# EAGLE design robo1 (EAGLE 8.0.1)
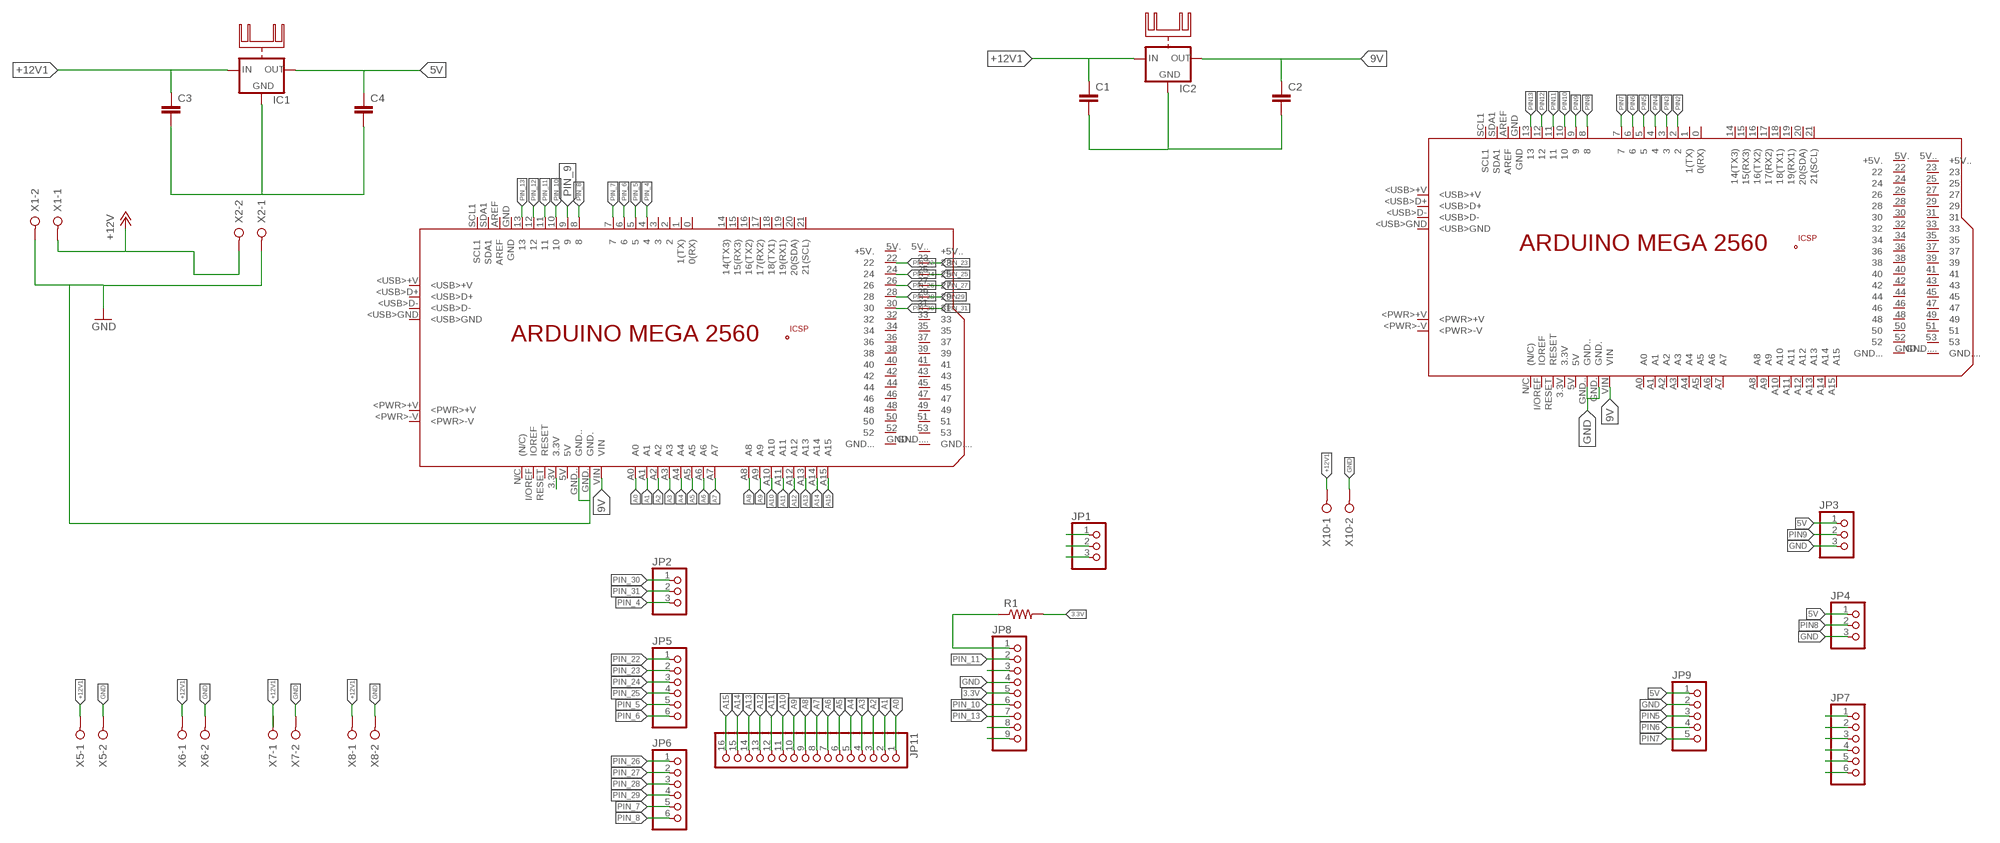
[diagram p0: schematic, sheet 1]

## Parts
C1  C5/2.5  [C5B2.5]
C2  C5/2.5  [C5B2.5]
C3  C5/2.5  [C5B2.5]
C4  C5/2.5  [C5B2.5]
IC1  78XXH  [78XXH]
IC2  78XXH  [78XXH]
JP1  PINHD-1X3  [1X03]
JP2  PINHD-1X3  [1X03]
JP3  PINHD-1X3  [1X03]
JP4  PINHD-1X3  [1X03]
JP5  PINHD-1X6  [1X06]
JP6  PINHD-1X6  [1X06]
JP7  PINHD-1X6  [1X06]
JP8  PINHD-1X9  [1X09]
JP9  PINHD-1X5  [1X05]
JP11  PINHD-1X16  [1X16]
MEGA1  ARDUINO_MEGA2560  [ARDUINO_MEGA2560]
MEGA2  ARDUINO_MEGA2560  [ARDUINO_MEGA2560]
R1  R-US_0207/10  [0207/10]
X1  W237-02P  [W237-132]
X2  W237-02P  [W237-132]
X5  W237-02P  [W237-132]
X6  W237-02P  [W237-132]
X7  W237-02P  [W237-132]
X8  W237-02P  [W237-132]
X10  W237-02P  [W237-132]

## Nets
3.3V: JP8.5 MEGA1.3.3V R1.2
5V: C4.1 IC1.OUT JP3.1 JP4.1 JP9.1
9V: C2.1 IC2.OUT MEGA1.VIN MEGA2.VIN
+12V: X1.1 X2.2
+12V1: C1.1 C3.1 IC1.IN IC2.IN X5.1 X6.1 X8.1 X10.1
A0: JP11.1 MEGA1.A0
A1: JP11.2 MEGA1.A1
A2: JP11.3 MEGA1.A2
A3: JP11.4 MEGA1.A3
A4: JP11.5 MEGA1.A4
A5: JP11.6 MEGA1.A5
A6: JP11.7 MEGA1.A6
A7: JP11.8 MEGA1.A7
A8: JP11.9 MEGA1.A8
A9: JP11.10 MEGA1.A9
A10: JP11.11 MEGA1.A10
A11: JP11.12 MEGA1.A11
A12: JP11.13 MEGA1.A12
A13: JP11.14 MEGA1.A13
A14: JP11.15 MEGA1.A14
A15: JP11.16 MEGA1.A15
GND: C1.2 C2.2 C3.2 C4.2 IC1.GND IC2.GND JP1.1 JP3.3 JP4.3 JP8.4 JP9.2 MEGA1.GND. MEGA1.GND.. MEGA2.GND. MEGA2.GND.. X1.2 X2.1 X5.2 X6.2 X7.2 X8.2 X10.2
N$26: JP1.2
N$34: JP8.3
N$39: JP8.8
N$40: JP8.9
PIN2: JP7.1 MEGA2.2
PIN3: JP7.2 MEGA2.3
PIN4: MEGA2.4
PIN5: JP9.3 MEGA2.5
PIN6: JP9.4 MEGA2.6
PIN7: JP9.5 MEGA2.7
PIN8: JP4.2 MEGA2.8
PIN9: JP3.2 MEGA2.9
PIN10: JP7.3 MEGA2.10
PIN11: JP7.4 MEGA2.11
PIN12: JP7.5 MEGA2.12
PIN13: JP7.6 MEGA2.13
PIN_4: JP2.3 MEGA1.4
PIN_5: JP5.5 MEGA1.5
PIN_6: JP5.6 MEGA1.6
PIN_7: JP6.5 MEGA1.7
PIN_8: JP6.6 MEGA1.8
PIN_9: JP1.3 MEGA1.9
PIN_10: JP8.6 MEGA1.10
PIN_11: JP8.2 MEGA1.11
PIN_12: JP8.1 MEGA1.12 R1.1
PIN_13: JP8.7 MEGA1.13
PIN_22: JP5.1 MEGA1.22
PIN_23: JP5.2
PIN_24: JP5.3 MEGA1.24
PIN_25: JP5.4
PIN_26: JP6.1 MEGA1.26
PIN_27: JP6.2
PIN_28: JP6.3 MEGA1.28
PIN_29: JP6.4
PIN_30: JP2.1 MEGA1.30
PIN_31: JP2.2
Unconnected: MEGA1.0(0(RX)) MEGA1.1(1(TX)) MEGA1.2 MEGA1.3 MEGA1.5V MEGA1.5V.(+5V.) MEGA1.5V..(+5V..) MEGA1.14(14(TX3)) MEGA1.15(15(RX3)) MEGA1.16(16(TX2)) MEGA1.17(17(RX2)) MEGA1.18(18(TX1)) MEGA1.19(19(RX1)) MEGA1.20(20(SDA)) MEGA1.21(21(SCL)) MEGA1.23 MEGA1.25 MEGA1.27 MEGA1.29 MEGA1.31 MEGA1.32 MEGA1.33 MEGA1.34 MEGA1.35 MEGA1.36 MEGA1.37 MEGA1.38 MEGA1.39 MEGA1.40 MEGA1.41 MEGA1.42 MEGA1.43 MEGA1.44 MEGA1.45 MEGA1.46 MEGA1.47 MEGA1.48 MEGA1.49 MEGA1.50 MEGA1.51 MEGA1.52 MEGA1.53 MEGA1.+5V_ MEGA1.<PWR>+V MEGA1.<PWR>-V MEGA1.<USB>+V MEGA1.<USB>D+ MEGA1.<USB>D- MEGA1.<USB>GND MEGA1.AREF MEGA1.GND MEGA1.GND... MEGA1.GND.... MEGA1.GND__ MEGA1.I/OREF(IOREF) MEGA1.MISO MEGA1.MOSI MEGA1.N/C((N/C)) MEGA1.RESET MEGA1.RESET. MEGA1.SCK MEGA1.SCL1 MEGA1.SDA1 MEGA2.0(0(RX)) MEGA2.1(1(TX)) MEGA2.3.3V MEGA2.5V MEGA2.5V.(+5V.) MEGA2.5V..(+5V..) MEGA2.14(14(TX3)) MEGA2.15(15(RX3)) MEGA2.16(16(TX2)) MEGA2.17(17(RX2)) MEGA2.18(18(TX1)) MEGA2.19(19(RX1)) MEGA2.20(20(SDA)) MEGA2.21(21(SCL)) MEGA2.22 MEGA2.23 MEGA2.24 MEGA2.25 MEGA2.26 MEGA2.27 MEGA2.28 MEGA2.29 MEGA2.30 MEGA2.31 MEGA2.32 MEGA2.33 MEGA2.34 MEGA2.35 MEGA2.36 MEGA2.37 MEGA2.38 MEGA2.39 MEGA2.40 MEGA2.41 MEGA2.42 MEGA2.43 MEGA2.44 MEGA2.45 MEGA2.46 MEGA2.47 MEGA2.48 MEGA2.49 MEGA2.50 MEGA2.51 MEGA2.52 MEGA2.53 MEGA2.+5V_ MEGA2.<PWR>+V MEGA2.<PWR>-V MEGA2.<USB>+V MEGA2.<USB>D+ MEGA2.<USB>D- MEGA2.<USB>GND MEGA2.A0 MEGA2.A1 MEGA2.A2 MEGA2.A3 MEGA2.A4 MEGA2.A5 MEGA2.A6 MEGA2.A7 MEGA2.A8 MEGA2.A9 MEGA2.A10 MEGA2.A11 MEGA2.A12 MEGA2.A13 MEGA2.A14 MEGA2.A15 MEGA2.AREF MEGA2.GND MEGA2.GND... MEGA2.GND.... MEGA2.GND__ MEGA2.I/OREF(IOREF) MEGA2.MISO MEGA2.MOSI MEGA2.N/C((N/C)) MEGA2.RESET MEGA2.RESET. MEGA2.SCK MEGA2.SCL1 MEGA2.SDA1 X7.1

## Library data of the parts
C1-C4 = capacitor-wima:C: CAPACITOR naming: grid - package width; OC_FARNELL: unknown
IC1 IC2 = 78xx_with_heatsink:78XXH: VOLTAGE REGULATOR; OC_FARNELL: unknown
JP1-JP4 = pinhead:PINHD-1X3: PIN HEADER
JP5-JP7 = pinhead:PINHD-1X6: PIN HEADER
JP8 = pinhead:PINHD-1X9: PIN HEADER
JP9 = pinhead:PINHD-1X5: PIN HEADER
JP11 = pinhead:PINHD-1X16: PIN HEADER
MEGA1 MEGA2 = E14_Arduino_revC:ARDUINO_MEGA2560: Device for representing an Arduino Mega 2560 board with a footprint in an EAGLE design. Created by Dave Young for Element14. More EAGLE documentation at: http://www.element14.com/community/community/knode/cadsoft_eagle; OC_FARNELL: unknown
R1 = resistor:R-US_: RESISTOR, American symbol; OC_FARNELL: unknown
X1 X2 X5-X8 X10 = con-wago-508:W237-02P: WAGO SREW CLAMP; OC_FARNELL: unknown; OC_NEWARK: unknown

## Board
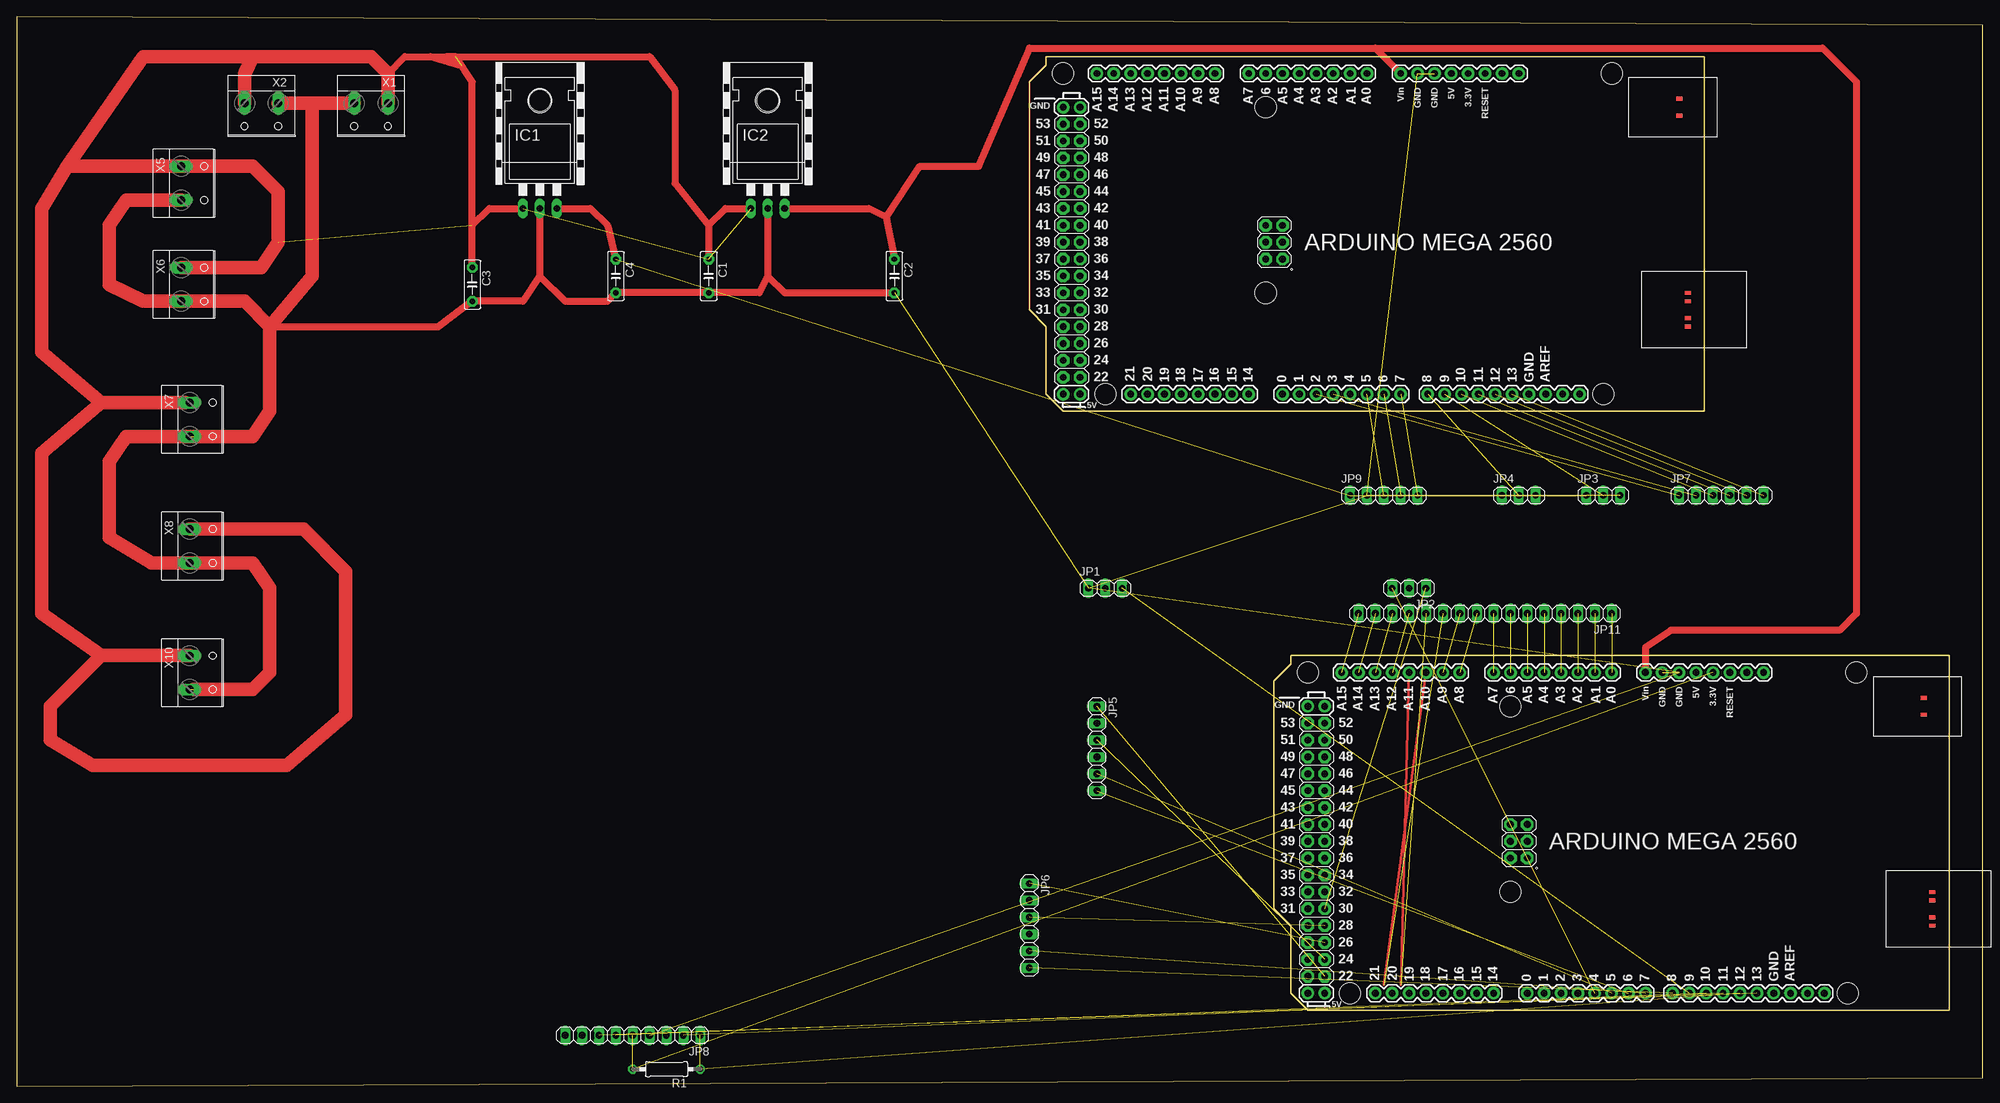
[diagram p1: board, top side]

Size 295.89 x 160.96 mm. Coordinates in mm from the lower left corner, seen from the top.
Outline: 0,0 295.89,1.27 295.89,159.69 0,160.96 0,0
Copper layers (1*16): Top 0.035mm / dielectric 1.5mm / Bottom 0.035mm
Design rules "default": minimum track width 10mil, minimum drill 24mil, track to track 8mil, track to pad 8mil, pad to pad 8mil, via to via 8mil, smd to smd 8mil, copper to edge 40mil, drill to drill 8mil, minimum pad ring 10mil, minimum via ring 8mil, stop-mask expansion 4mil, vias tented up to drill 0mil, thermal gap 10mil
Holes 2.8 mm at -27.18,-42.42 -0.76,-42.42 -0.76,-7.11 -27.18,-7.11

### Footprints (pad centres in the part's own frame; a part is rotated, then mirrored left to right if it is on the bottom)
C5B2.5 = drill 0.813 pad 1.6 octagon: 1 -2.54,0; 2 2.54,0
78XXH = drill 1.016 long: GND 0,-5.08; IN -2.54,-5.08; OUT 2.54,-5.08 | hole 3.302: 0,11.176
1X03 = drill 1.016 long: 1 -2.54,0; 2 0,0; 3 2.54,0
1X06 = drill 1.016 long: 1 -6.35,0; 2 -3.81,0; 3 -1.27,0; 4 1.27,0; 5 3.81,0; 6 6.35,0
1X09 = drill 1.016 long: 1 -10.16,0; 2 -7.62,0; 3 -5.08,0; 4 -2.54,0; 5 0,0; 6 2.54,0; 7 5.08,0; 8 7.62,0; 9 10.16,0
1X05 = drill 1.016 long: 1 -5.08,0; 2 -2.54,0; 3 0,0; 4 2.54,0; 5 5.08,0
1X16 = drill 1.016 long: 1 -19.05,0; 2 -16.51,0; 3 -13.97,0; 4 -11.43,0; 5 -8.89,0; 6 -6.35,0; 7 -3.81,0; 8 -1.27,0; 9 1.27,0; 10 3.81,0; 11 6.35,0; 12 8.89,0; 13 11.43,0; 14 13.97,0; 15 16.51,0; 16 19.05,0
ARDUINO_MEGA2560 = drill 1.016 pad 1.88: 0 63.5,50.8; 1 60.96,50.8; 2 58.42,50.8; 3 55.88,50.8; 3.3V 35.56,2.54; 4 53.34,50.8; 5 50.8,50.8; 5V 38.1,2.54; 5V. 93.98,50.8; 5V.. 96.52,50.8; 6 48.26,50.8; 7 45.72,50.8; 8 41.656,50.8; 9 39.116,50.8; 10 36.576,50.8; 11 34.036,50.8; 12 31.496,50.8; 13 28.956,50.8; 14 68.58,50.8; 15 71.12,50.8; 16 73.66,50.8; 17 76.2,50.8; 18 78.74,50.8; 19 81.28,50.8; 20 83.82,50.8; 21 86.36,50.8; A0 50.8,2.54; A1 53.34,2.54; A2 55.88,2.54; A3 58.42,2.54; A4 60.96,2.54; A5 63.5,2.54; A6 66.04,2.54; A7 68.58,2.54; A8 73.66,2.54; A9 76.2,2.54; A10 78.74,2.54; A11 81.28,2.54; A12 83.82,2.54; A13 86.36,2.54; A14 88.9,2.54; A15 91.44,2.54; AREF 23.876,50.8; GND 26.416,50.8; GND. 43.18,2.54; GND.. 40.64,2.54; GND... 93.98,7.62; GND.... 96.52,7.62; I/OREF 30.48,2.54; N/C 27.94,2.54; RESET 33.02,2.54; SCL1 18.796,50.8; SDA1 21.336,50.8; VIN 45.72,2.54 | drill 1.016 pad 1.88 octagon: 22 93.98,48.26; 23 96.52,48.26; 24 93.98,45.72; 25 96.52,45.72; 26 93.98,43.18; 27 96.52,43.18; 28 93.98,40.64; 29 96.52,40.64; 30 93.98,38.1; 31 96.52,38.1; 32 93.98,35.56; 33 96.52,35.56; 34 93.98,33.02; 35 96.52,33.02; 36 93.98,30.48; 37 96.52,30.48; 38 93.98,27.94; 39 96.52,27.94; 40 93.98,25.4; 41 96.52,25.4; 42 93.98,22.86; 43 96.52,22.86; 44 93.98,20.32; 45 96.52,20.32; 46 93.98,17.78; 47 96.52,17.78; 48 93.98,15.24; 49 96.52,15.24; 50 93.98,12.7; 51 96.52,12.7; 52 93.98,10.16; 53 96.52,10.16; +5V_ 66.04,30.48; GND__ 66.04,25.4; MISO 63.5,30.48; MOSI 66.04,27.94; RESET. 63.5,25.4; SCK 63.5,27.94 | smd 1.016 x 0.508: <PWR>+V 3.81,8.89; <PWR>-V 3.81,6.35; <USB>+V 2.54,40.64; <USB>D+ 2.54,39.37; <USB>D- 2.54,36.83; <USB>GND 2.54,35.56 | hole 3.2: 15.24,50.8; 13.97,2.54; 66.04,35.56; 66.04,7.62; 90.17,50.8; 96.52,2.54
0207/10 = drill 0.813 octagon: 1 -5.08,0; 2 5.08,0
W237-132 = drill 1.194 long: 1 -2.54,-0.635; 2 2.54,-0.635

### Placement (x,y rotation side)
C1  104.14,121.92 270 top
C2  132.08,121.92 270 top
C3  68.58,120.65 270 top
C4  90.17,121.92 270 top
IC1  78.74,137.16 0 top
IC2  113.03,137.16 0 top
JP1  163.83,74.93 0 top
JP2  209.55,74.93 180 top
JP3  238.76,88.9 0 top
JP4  226.06,88.9 0 top
JP5  162.56,50.8 270 top
JP6  152.4,24.13 270 top
JP7  256.54,88.9 0 top
JP8  92.71,7.62 180 top
JP9  205.74,88.9 0 top
JP11  220.98,71.12 180 top
MEGA1  290.83,64.77 180 top
MEGA2  254,154.94 180 top
R1  97.79,2.54 180 top
X1  53.34,147.32 180 top
X2  36.83,147.32 180 top
X5  25.4,135.89 270 top
X6  25.4,120.65 270 top
X7  26.67,100.33 270 top
X8  26.67,81.28 270 top
X10  26.67,62.23 270 top

### Tracks (layer width: path | path; a pad name or v marks a point on that pad's centre or on a via)
3.3V  (2 unrouted)
5V  (3 unrouted)
  Top 1.016: IC1.OUT 86.36,132.08 88.9,129.54 C4.1
9V
  Top 1.016: IC2.OUT 128.27,132.08 130.81,130.81 | 130.81,130.81 C2.1 | 130.81,130.81 135.89,138.43 144.78,138.43 152.4,156.21 204.47,156.21 | 204.47,156.21 MEGA2.VIN | 204.47,156.21 271.78,156.21 276.86,151.13 276.86,71.12 274.32,68.58 248.92,68.58 245.11,66.04 MEGA1.VIN
+12V
  Top 1.016: 55.88,152.4 58.42,154.94 95.25,154.94 99.06,149.86 99.06,135.89 104.14,129.54 | 104.14,129.54 104.14,124.46 | 104.14,129.54 106.68,132.08 110.49,132.08
  Top 2.032: X2.2 34.29,152.4 35.56,154.94 | 35.56,154.94 53.34,154.94 55.88,152.4 X1.1 | 35.56,154.94 19.05,154.94 7.62,138.43
+12V1  (4 unrouted)
  Top 1.016: C3.1 68.58,129.54 | 68.58,129.54 68.58,151.13 66.04,154.94 64.77,154.94 | 68.58,129.54 71.12,132.08 IC1.IN | 67.02,153.48 62.23,154.94
  Top 2.032: X6.1 36.83,123.19 39.37,127 39.37,134.62 35.56,138.43 X5.1 7.62,138.43 3.81,132.08 3.81,110.49 12.7,102.87 | 12.7,102.87 25.4,102.87 | 12.7,102.87 3.81,95.25 3.81,71.12 12.7,64.77 | 12.7,64.77 X10.1 | X8.1 43.18,83.82 49.53,77.47 49.53,55.88 40.64,48.26 11.43,48.26 5.08,52.07 5.08,57.15 12.7,64.77
A0  (1 unrouted)
A1  (1 unrouted)
A2  (1 unrouted)
A3  (1 unrouted)
A4  (1 unrouted)
A5  (1 unrouted)
A6  (1 unrouted)
A7  (1 unrouted)
A8  (1 unrouted)
A9  (1 unrouted)
A10  (1 unrouted)
  Top 0.406: 205.74,15.24 MEGA1.A10
A11  (1 unrouted)
  Top 0.406: 208.28,15.24 MEGA1.A11
A12  (1 unrouted)
A13  (1 unrouted)
A14  (1 unrouted)
A15  (1 unrouted)
GND  (11 unrouted)
  Top 1.016: 38.1,114.3 63.5,114.3 C3.2 76.2,118.11 78.74,121.92 | IC1.GND 78.74,121.92 | 78.74,121.92 82.55,118.11 88.9,118.11 C4.2 C1.2 111.76,119.38 113.03,121.92 | IC2.GND 113.03,121.92 | 113.03,121.92 115.57,119.38 C2.2
  Top 2.032: X2.1 44.45,147.96 | 44.45,147.96 X1.2 | X5.2 16.51,133.35 13.97,129.54 13.97,120.65 19.05,118.11 X6.2 34.29,118.11 38.1,114.3 | 38.1,114.3 38.1,101.6 35.56,97.79 26.67,97.79 | X7.2 16.51,97.79 13.97,93.98 13.97,82.55 20.32,78.74 X8.2 35.56,78.74 38.1,74.93 38.1,62.23 35.56,59.69 26.67,59.69 | 44.45,147.96 44.45,121.92 38.1,114.3
PIN2  (1 unrouted)
PIN3  (1 unrouted)
PIN5  (1 unrouted)
PIN6  (1 unrouted)
PIN7  (1 unrouted)
PIN8  (1 unrouted)
PIN9  (1 unrouted)
PIN10  (1 unrouted)
PIN11  (1 unrouted)
PIN12  (1 unrouted)
PIN13  (1 unrouted)
PIN_4  (1 unrouted)
PIN_5  (1 unrouted)
PIN_6  (1 unrouted)
PIN_7  (1 unrouted)
PIN_8  (1 unrouted)
PIN_9  (1 unrouted)
PIN_10  (1 unrouted)
PIN_11  (1 unrouted)
PIN_12  (2 unrouted)
PIN_13  (1 unrouted)
PIN_22  (1 unrouted)
PIN_24  (1 unrouted)
PIN_26  (1 unrouted)
PIN_28  (1 unrouted)
PIN_30  (1 unrouted)